# EAGLE design Sensor (EAGLE 7.2.0)
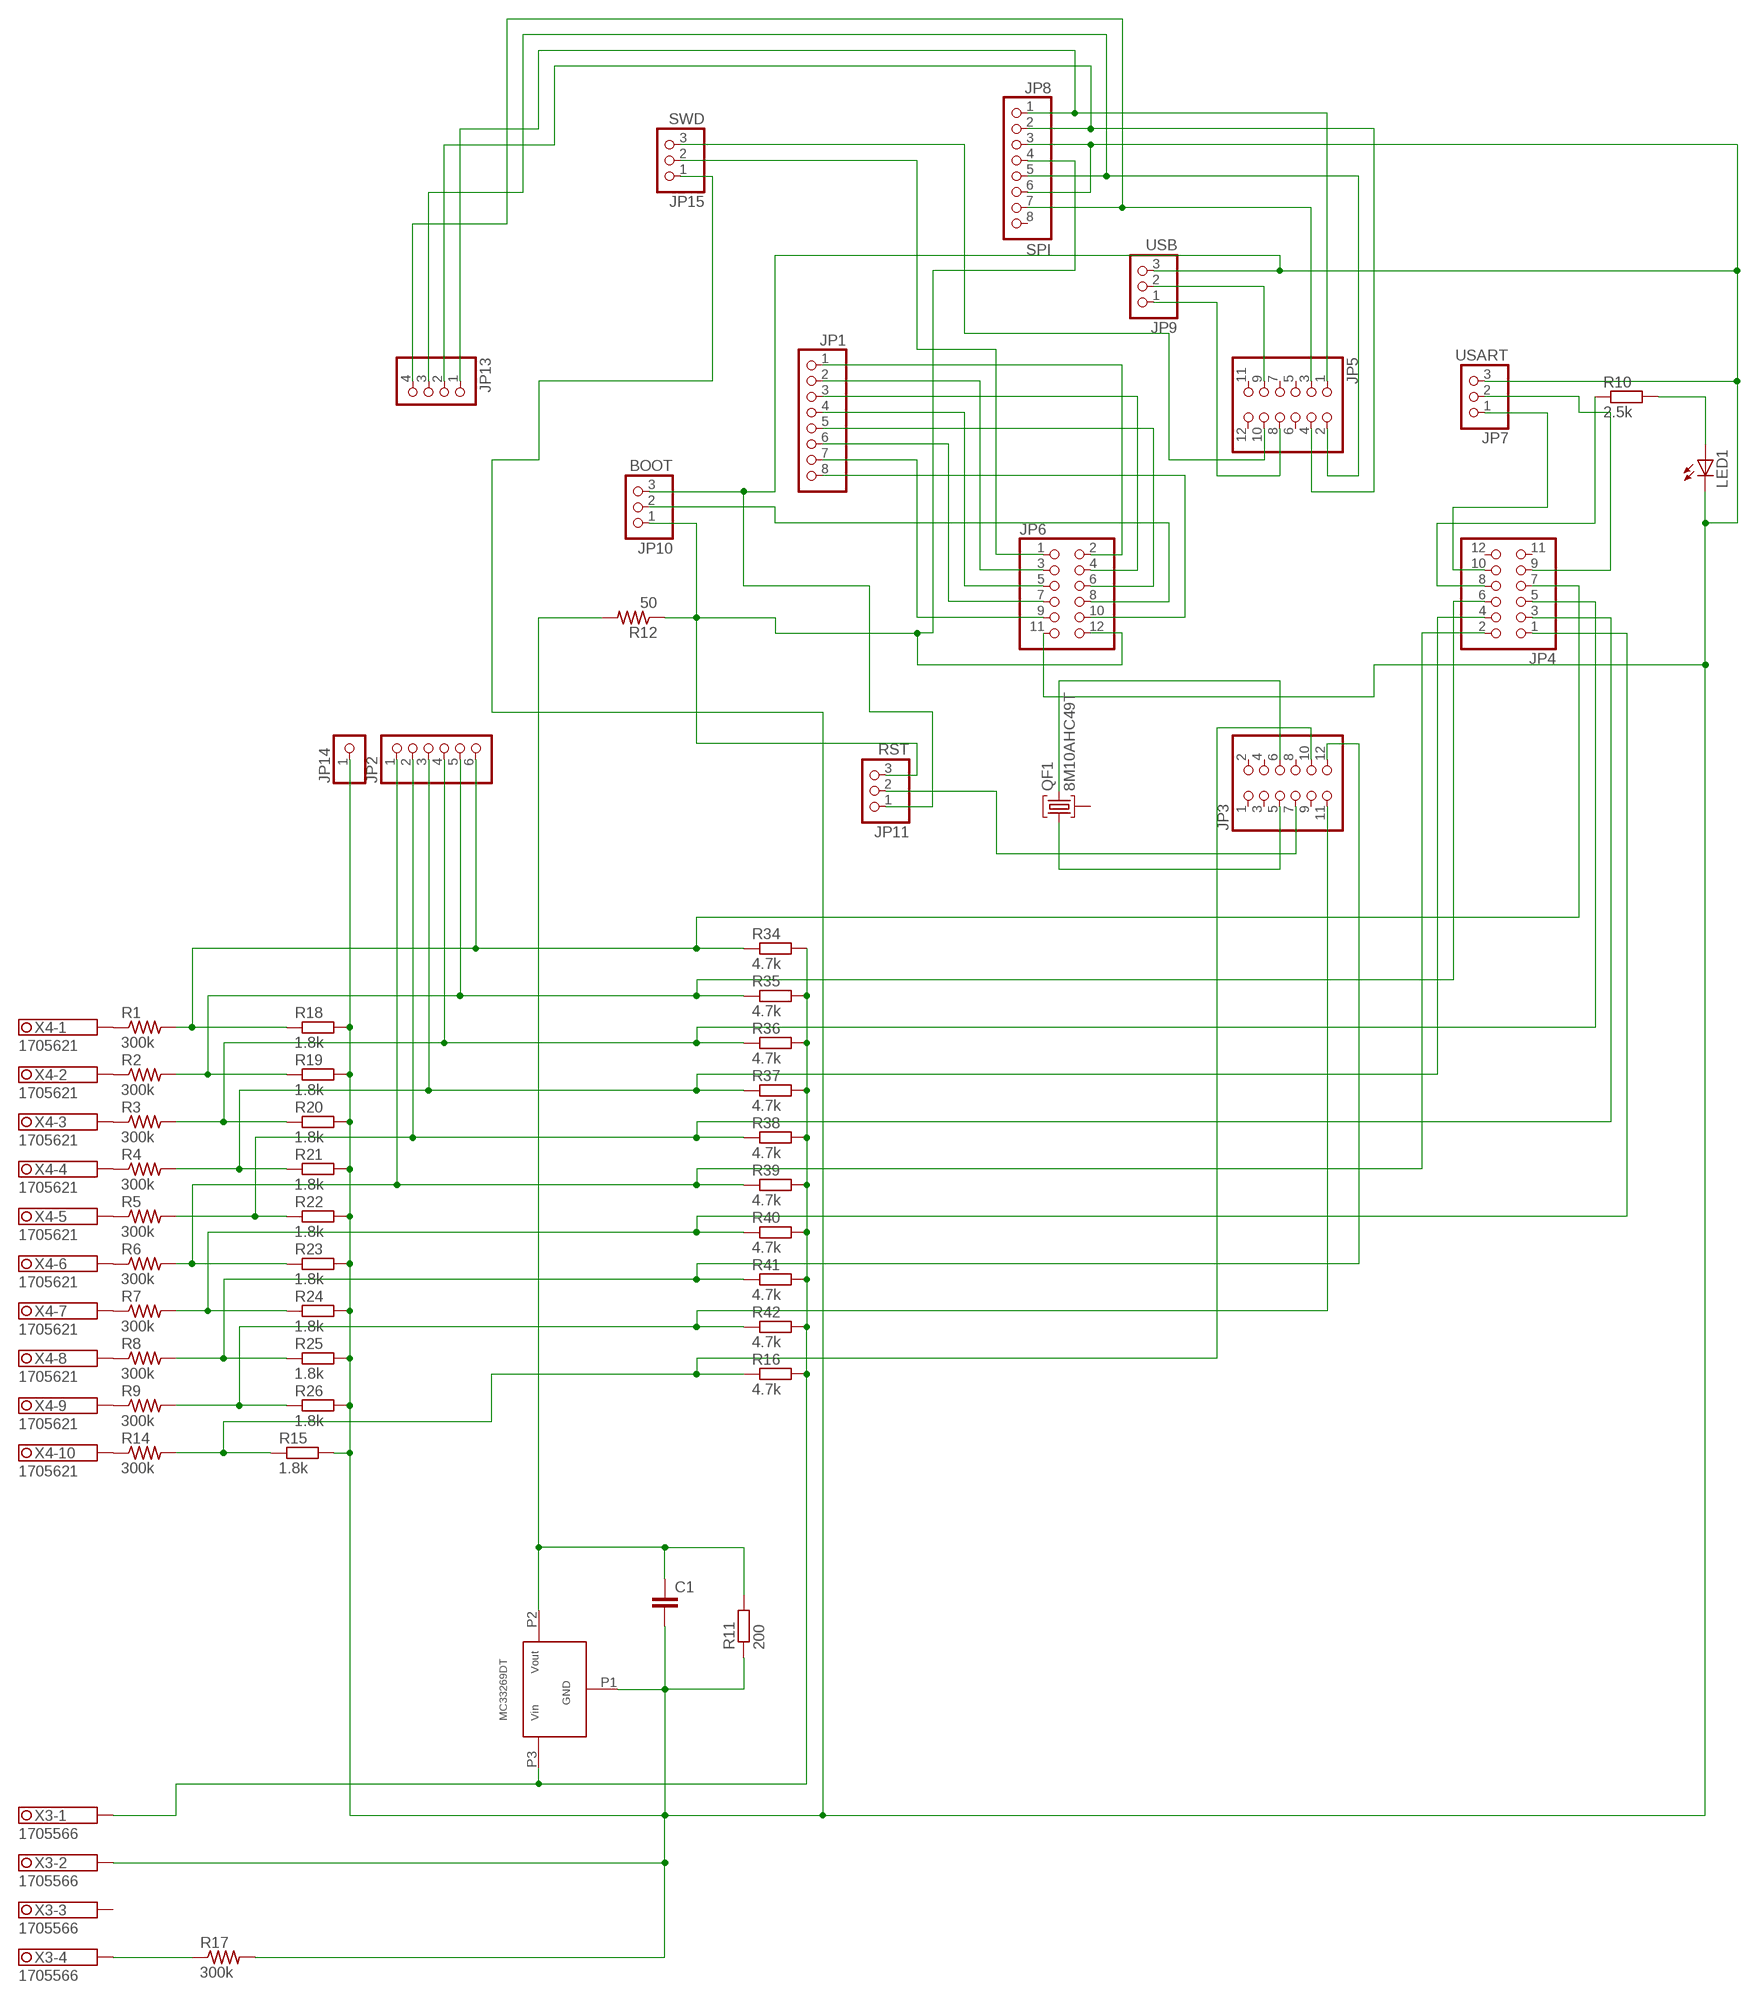
[diagram p0: schematic, sheet 1]

## Parts
C1  C2.5/6  [C2.5-6]
JP1  PINHD-1X8  [1X08]
JP2  PINHD-1X6  [1X06]
JP3  PINHD-2X6  [2X06]
JP4  PINHD-2X6  [2X06]
JP5  PINHD-2X6  [2X06]
JP6  PINHD-2X6  [2X06]
JP7  USART  PINHD-1X3  [1X03]
JP8  SPI  PINHD-1X8  [1X08]
JP9  USB  PINHD-1X3  [1X03]
JP10  BOOT  PINHD-1X3  [1X03]
JP11  RST  PINHD-1X3  [1X03]
JP13  PINHD-1X4  [1X04]
JP14  PINHD-1X1  [1X01]
JP15  SWD  PINHD-1X3  [1X03]
LED1  LED3MM  [LED3MM]
QF1  8M10AHC49T  [HC49U]
R1  300k  R-US_0207/15  [0207/15]
R2  300k  R-US_0207/15  [0207/15]
R3  300k  R-US_0207/15  [0207/15]
R4  300k  R-US_0207/15  [0207/15]
R5  300k  R-US_0207/15  [0207/15]
R6  300k  R-US_0207/15  [0207/15]
R7  300k  R-US_0207/15  [0207/15]
R8  300k  R-US_0207/15  [0207/15]
R9  300k  R-US_0207/15  [0207/15]
R10  2.5k  R-EU_M1206  [M1206]
R11  200  R-EU_R1206  [R1206]
R12  50  R-US_0207/15  [0207/15]
R14  300k  R-US_0207/15  [0207/15]
R15  1.8k  R-EU_R1206  [R1206]
R16  4.7k  R-EU_R1206  [R1206]
R17  300k  R-US_0207/15  [0207/15]
R18  1.8k  R-EU_R1206  [R1206]
R19  1.8k  R-EU_R1206  [R1206]
R20  1.8k  R-EU_R1206  [R1206]
R21  1.8k  R-EU_R1206  [R1206]
R22  1.8k  R-EU_R1206  [R1206]
R23  1.8k  R-EU_R1206  [R1206]
R24  1.8k  R-EU_R1206  [R1206]
R25  1.8k  R-EU_R1206  [R1206]
R26  1.8k  R-EU_R1206  [R1206]
R34  4.7k  R-EU_R1206  [R1206]
R35  4.7k  R-EU_R1206  [R1206]
R36  4.7k  R-EU_R1206  [R1206]
R37  4.7k  R-EU_R1206  [R1206]
R38  4.7k  R-EU_R1206  [R1206]
R39  4.7k  R-EU_R1206  [R1206]
R40  4.7k  R-EU_R1206  [R1206]
R41  4.7k  R-EU_R1206  [R1206]
R42  4.7k  R-EU_R1206  [R1206]
U$3  MC33269DT  [MC33269DT]
X3  1705566  [1705566]
X4  1705621  [1705621]

## Nets
N$1: JP3.10 R14.2 R15.1 R16.1
N$2: R17.1 X3.4.1 X3.4.2
N$3: R1.1 X4.1.1 X4.1.2
N$4: R2.1 X4.2.1 X4.2.2
N$5: R3.1 X4.3.1 X4.3.2
N$6: R4.1 X4.4.1 X4.4.2
N$7: R5.1 X4.5.1 X4.5.2
N$8: R6.1 X4.6.1 X4.6.2
N$9: R7.1 X4.7.1 X4.7.2
N$10: JP3.5 QF1.1
N$11: JP3.6 QF1.3
N$12: JP3.7 JP11.2
N$13: R8.1 X4.8.1 X4.8.2
N$14: LED1.A R10.2
N$16: JP4.8 R10.1
N$17: R16.2 R34.2 R35.2 R36.2 R37.2 R38.2 R39.2 R40.2 R41.2 R42.2 U$3.P3(VIN) X3.1.1 X3.1.2
N$18: JP2.6 JP4.7 R1.2 R18.1 R34.1
N$19: JP2.5 JP4.6 R2.2 R19.1 R35.1
N$20: JP2.4 JP4.5 R3.2 R20.1 R36.1
N$21: JP2.3 JP4.4 R4.2 R21.1 R37.1
N$22: JP2.2 JP4.3 R5.2 R22.1 R38.1
N$23: JP2.1 JP4.2 R6.2 R23.1 R39.1
N$24: JP4.1 R7.2 R24.1 R40.1
N$25: JP3.12 R8.2 R25.1 R41.1
N$26: JP3.11 R9.2 R26.1 R42.1
N$27: JP4.9 JP7.2
N$28: JP4.10 JP7.1
N$29: C1.2 JP6.11 JP7.3 JP8.3 JP8.6 JP9.3 JP10.3 JP11.1 JP14.1 JP15.1 LED1.K(C) R11.1 R15.2 R17.2 R18.2 R19.2 R20.2 R21.2 R22.2 R23.2 R24.2 R25.2 R26.2 U$3.P1(GND) X3.2.1 X3.2.2
N$30: C1.1 R11.2 R12.2 U$3.P2(VOUT)
N$31: JP5.8 JP9.1
N$32: JP5.9 JP9.2
N$34: JP5.10 JP15.3
N$35: JP6.1 JP15.2
N$36: JP5.1 JP8.1 JP13.1
N$37: JP5.4 JP8.2 JP13.2
N$38: JP5.2 JP8.5 JP13.3
N$39: JP5.3 JP8.7 JP13.4
N$40: JP6.12 JP8.4 JP10.1 JP11.3 R12.1
N$42: JP1.1 JP6.2
N$45: JP1.2 JP6.3
N$46: JP1.3 JP6.4
N$47: JP1.4 JP6.5
N$48: JP1.5 JP6.6
N$49: JP1.6 JP6.7
N$50: JP1.7 JP6.9
N$51: JP1.8 JP6.10
N$53: R9.1 X4.9.1 X4.9.2
N$54: R14.1 X4.10.1 X4.10.2
N$56: JP6.8 JP10.2
Unconnected: JP3.1 JP3.2 JP3.3 JP3.4 JP3.8 JP3.9 JP4.11 JP4.12 JP5.5 JP5.6 JP5.7 JP5.11 JP5.12 JP8.8 QF1.2 X3.3.1 X3.3.2

## Library data of the parts
C1 = capacitor-wima:C: CAPACITOR naming: grid - package width
JP1 JP8 = pinhead:PINHD-1X8: PIN HEADER
JP2 = pinhead:PINHD-1X6: PIN HEADER
JP3-JP6 = pinhead:PINHD-2X6: PIN HEADER
JP7 JP9-JP11 JP15 = pinhead:PINHD-1X3: PIN HEADER
JP13 = pinhead:PINHD-1X4: PIN HEADER
JP14 = pinhead:PINHD-1X1: PIN HEADER
LED1 = led:LED: LED OSRAM: - CHIPLED LG R971, LG N971, LY N971, LG Q971, LY Q971, LO R971, LY R971 LH N974, LH R974 LS Q976, LO Q976, LY Q976 LO Q996 - Hyper CHIPLED LW Q18S LB Q993, LB Q99A, LB R99A - SideLED LS A670, LO A670, LY A670, LG A670, LP A670 LB A673, LV A673, LT A673, LW A673 LH A674 LY A675 LS A676, LA A676, LO A676, LY A676, LW A676 LS A679, LY A679, LG A679 - Hyper Micro SIDELED® LS Y876, LA Y876, LO Y876, LY Y876 LT Y87S - SmartLED LW L88C, LW L88S LB L89C, LB L89S, LG L890 LS L89K, LO L89K, LY L89K LS L896, LA L896, LO L896, LY L896 - TOPLED LS T670, LO T670, LY T670, LG T670, LP T670 LSG T670, LSP T670, LSY T670, LOP T670, LYG T670 LG T671, LOG T671, LSG T671 LB T673, LV T673, LT T673, LW T673 LH T674 LS T676, LA T676, LO T676, LY T676, LB T676, LH T676, LSB T676, LW T676 LB T67C, LV T67C, LT T67C, LS T67K, LO T67K, LY T67K, LW E67C LS E67B, LA E67B, LO E67B, LY E67B, LB E67C, LV E67C, LT E67C LW T67C LS T679, LY T679, LG T679 LS T770, LO T770, LY T770, LG T770, LP T770 LB T773, LV T773, LT T773, LW T773 LH T774 LS E675, LA E675, LY E675, LS T675 LS T776, LA T776, LO T776, LY T776, LB T776 LHGB T686 LT T68C, LB T68C - Hyper Mini TOPLED® LB M676 - Mini TOPLED Santana® LG M470 LS M47K, LO M47K, LY M47K Source: http://www.osram.convergy.de LUXEON: - LUMILED® LXK2-PW12-R00, LXK2-PW12-S00, LXK2-PW14-U00, LXK2-PW14-V00 LXK2-PM12-R00, LXK2-PM12-S00, LXK2-PM14-U00 LXK2-PE12-Q00, LXK2-PE12-R00, LXK2-PE12-S00, LXK2-PE14-T00, LXK2-PE14-U00 LXK2-PB12-K00, LXK2-PB12-L00, LXK2-PB12-M00, LXK2-PB14-N00, LXK2-PB14-P00, LXK2-PB14-Q00 LXK2-PR12-L00, LXK2-PR12-M00, LXK2-PR14-Q00, LXK2-PR14-R00 LXK2-PD12-Q00, LXK2-PD12-R00, LXK2-PD12-S00 LXK2-PH12-R00, LXK2-PH12-S00 LXK2-PL12-P00, LXK2-PL12-Q00, LXK2-PL12-R00 Source: www.luxeon.com KINGBRIGHT: KA-3528ASYC Source: www.kingbright.com
QF1 = crystal:8M10AHC49T: Monolithic Crystal Filters Source: www.vanlong.com; OC_FARNELL: unknown; OC_NEWARK: unknown
R1-R9 R12 R14 R17 = resistor:R-US_: RESISTOR, American symbol
R10 R11 R15 R16 R18-R26 R34-R42 = resistor:R-EU_: RESISTOR, European symbol
U$3 = mc33269dt:MC33269DT
X3 = con-phoenix-3.81:1705566: MKDSD 1,5/ 4-3,81 Printklemme Nennstrom: 8 A Bemessungsspannung: 200 V Raster: 3,81 mm Polzahl: 4 Montageart: Löten Anschlussart: Schraubanschluss Anschlussrichtung vom Leiter zur Platine: 0° Source: http://eshop.phoenixcontact.com .. 1705566.pdf; OC_FARNELL: unknown; OC_NEWARK: unknown
X4 = con-phoenix-3.81:1705621: MKDSD 1,5/10-3,81 Printklemme Nennstrom: 8 A Bemessungsspannung: 200 V Raster: 3,81 mm Polzahl: 12 Montageart: Löten Anschlussart: Schraubanschluss Anschlussrichtung vom Leiter zur Platine: 0° Source: http://eshop.phoenixcontact.com .. 1705621.pdf; OC_FARNELL: unknown; OC_NEWARK: unknown

## Net classes
0 default: width 2.032 mm, clearance 0.205 mm

## Board
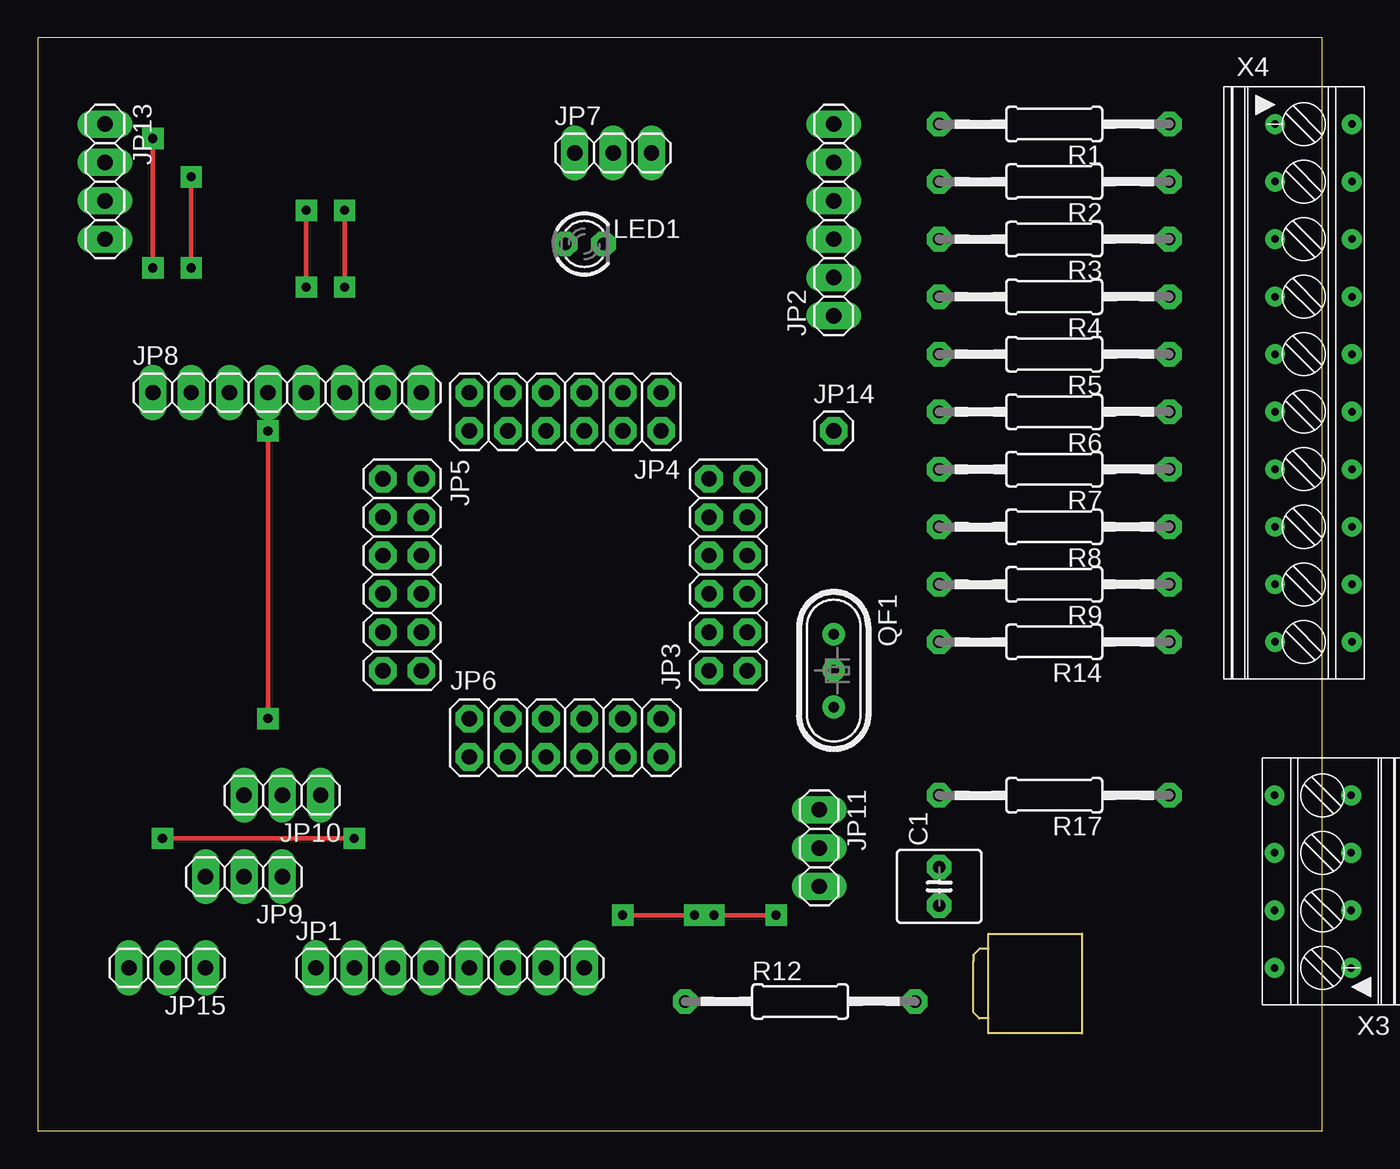
[diagram p1: board, top side]
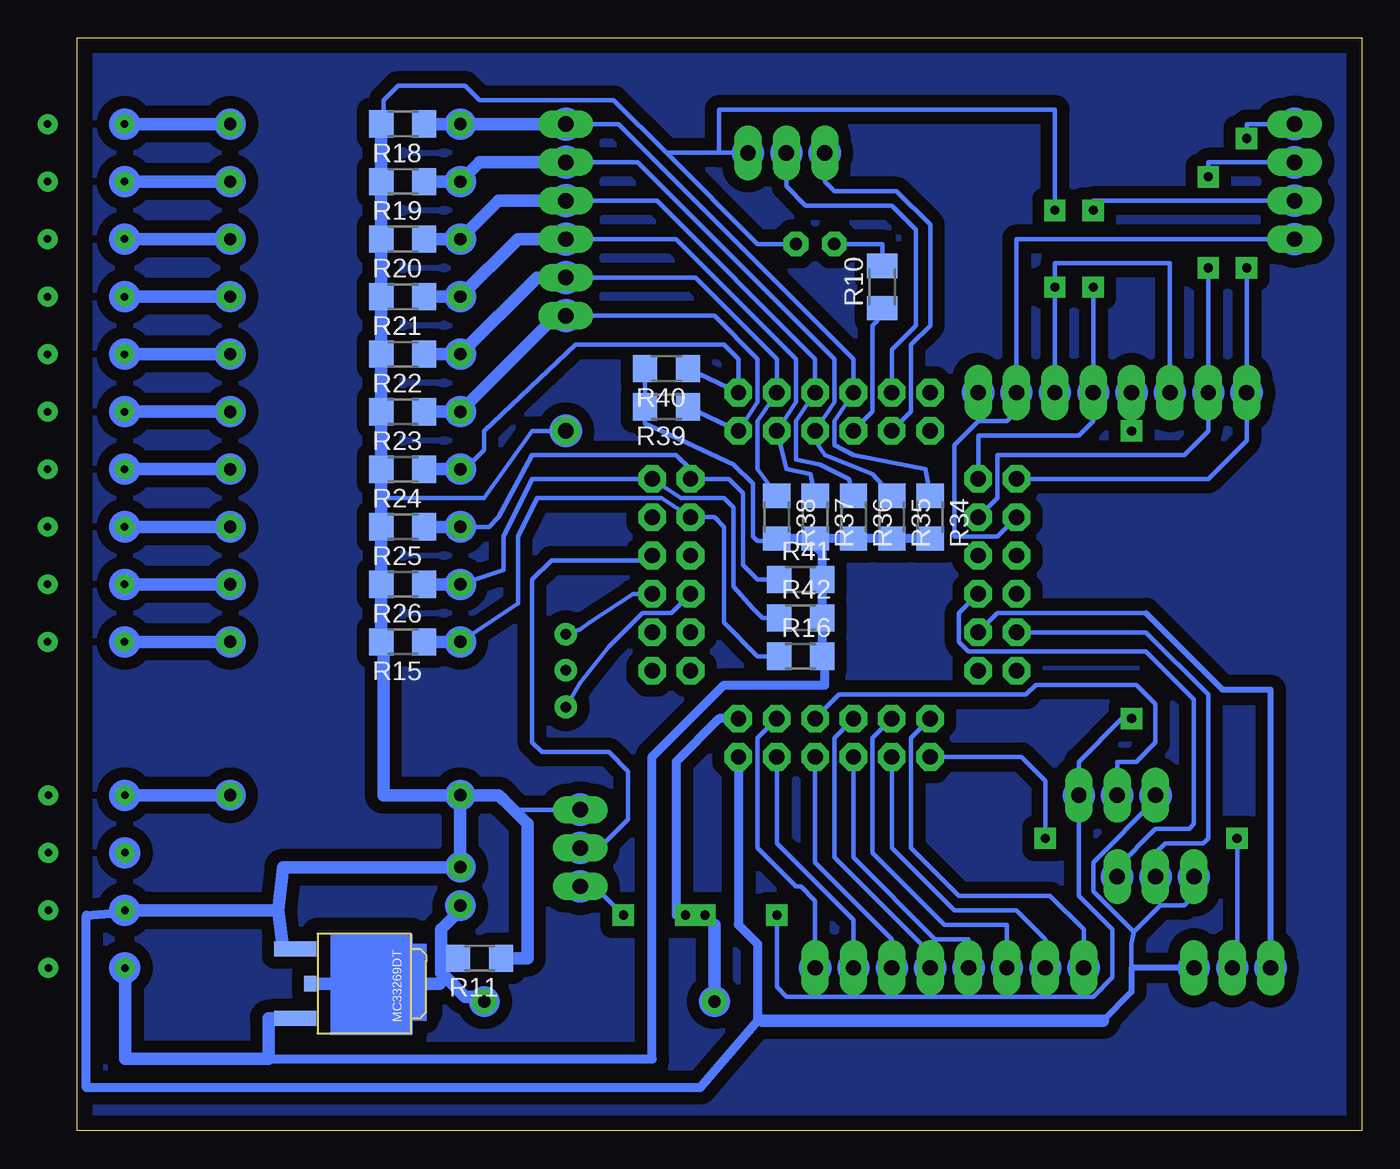
[diagram p2: board, bottom side, seen from below]

Size 85.07 x 72.39 mm. Coordinates in mm from the lower left corner, seen from the top.
Outline: 0,0 85.07,0 85.07,72.39 0,72.39 0,0
Copper layers (1*16): Top 0.035mm / dielectric 1.5mm / Bottom 0.035mm
Design rules "default *": minimum track width 10mil, minimum drill 24mil, track to track 8mil, track to pad 8mil, pad to pad 8mil, via to via 8mil, smd to smd 8mil, copper to edge 40mil, drill to drill 8mil, minimum pad ring 16mil, minimum via ring 16mil, stop-mask expansion 4mil, vias tented up to drill 0mil, thermal gap 10mil

### Footprints (pad centres in the part's own frame; a part is rotated, then mirrored left to right if it is on the bottom)
C2.5-6 = drill 0.813 pad 1.6 octagon: 1 -1.27,0; 2 1.27,0
1X08 = drill 1.016 long: 1 -8.89,0; 2 -6.35,0; 3 -3.81,0; 4 -1.27,0; 5 1.27,0; 6 3.81,0; 7 6.35,0; 8 8.89,0
1X06 = drill 1.016 long: 1 -6.35,0; 2 -3.81,0; 3 -1.27,0; 4 1.27,0; 5 3.81,0; 6 6.35,0
2X06 = drill 1.016 octagon: 1 -6.35,-1.27; 2 -6.35,1.27; 3 -3.81,-1.27; 4 -3.81,1.27; 5 -1.27,-1.27; 6 -1.27,1.27; 7 1.27,-1.27; 8 1.27,1.27; 9 3.81,-1.27; 10 3.81,1.27; 11 6.35,-1.27; 12 6.35,1.27
1X03 = drill 1.016 long: 1 -2.54,0; 2 0,0; 3 2.54,0
1X04 = drill 1.016 long: 1 -3.81,0; 2 -1.27,0; 3 1.27,0; 4 3.81,0
1X01 = drill 1.016 octagon: 1 0,0
LED3MM = drill 0.813 octagon: A -1.27,0; K 1.27,0
HC49U = drill 0.7 pad 1.2: 1 -2.413,0; 2 -0.027,0; 3 2.413,0
0207/15 = drill 0.813 octagon: 1 -7.62,0; 2 7.62,0
M1206 = smd 1.6 x 2: 1 -1.4,0; 2 1.4,0
R1206 = smd 1.6 x 1.803: 1 -1.422,0; 2 1.422,0
MC33269DT = smd 1 x 2.8: P1 -2.2,-4.59; P3 2.38,-4.59 | smd 1 x 0.8: P2 0.09,-3.59
1705566 = drill 0.5 pad 0.9: 1.1 -5.715,-1.25; 1.2 -5.715,3.83; 2.1 -1.905,-1.25; 2.2 -1.905,3.83; 3.1 1.905,-1.25; 3.2 1.905,3.83; 4.1 5.715,-1.25; 4.2 5.715,3.83
1705621 = drill 0.5 pad 0.9: 1.1 -17.145,-1.25; 1.2 -17.145,3.83; 2.1 -13.335,-1.25; 2.2 -13.335,3.83; 3.1 -9.525,-1.25; 3.2 -9.525,3.83; 4.1 -5.715,-1.25; 4.2 -5.715,3.83; 5.1 -1.905,-1.25; 5.2 -1.905,3.83; 6.1 1.905,-1.25; 6.2 1.905,3.83; 7.1 5.715,-1.25; 7.2 5.715,3.83; 8.1 9.525,-1.25; 8.2 9.525,3.83; 9.1 13.335,-1.25; 9.2 13.335,3.83; 10.1 17.145,-1.25; 10.2 17.145,3.83

### Placement (x,y rotation side)
C1  59.69,16.19 90 top
JP1  27.3,10.79 0 top
JP2  52.7,60.33 90 top
JP3  45.72,36.83 90 top
JP4  34.92,47.62 180 top
JP5  24.13,36.83 270 top
JP6  34.92,26.04 0 top
JP7  38.1,64.77 0 top
JP8  16.51,48.9 0 top
JP9  13.65,16.83 180 top
JP10  16.19,22.23 180 top
JP11  51.75,18.73 270 top
JP13  4.45,62.87 270 top
JP14  52.7,46.35 0 top
JP15  8.57,10.79 180 top
LED1  36.2,58.74 0 top
QF1  52.7,30.48 270 top
R1  67.31,66.67 180 top
R2  67.31,62.87 180 top
R3  67.31,59.05 180 top
R4  67.31,55.24 180 top
R5  67.31,51.44 180 top
R6  67.31,47.62 180 top
R7  67.31,43.81 180 top
R8  67.31,40.01 180 top
R9  67.31,36.2 180 top
R10  31.75,55.88 90 bottom
R11  58.42,11.43 180 bottom
R12  50.48,8.57 0 top
R14  67.31,32.38 180 top
R15  63.5,32.38 180 bottom
R16  37.15,31.43 0 bottom
R17  67.31,22.23 180 top
R18  63.5,66.67 180 bottom
R19  63.5,62.87 180 bottom
R20  63.5,59.05 180 bottom
R21  63.5,55.24 180 bottom
R22  63.5,51.44 180 bottom
R23  63.5,47.62 180 bottom
R24  63.5,43.81 180 bottom
R25  63.5,40.01 180 bottom
R26  63.5,36.2 180 bottom
R34  28.57,40.64 270 bottom
R35  31.11,40.64 270 bottom
R36  33.66,40.64 270 bottom
R37  36.2,40.64 270 bottom
R38  38.73,40.64 270 bottom
R39  46.04,47.94 180 bottom
R40  46.04,50.48 180 bottom
R41  37.15,36.51 0 bottom
R42  37.15,33.97 0 bottom
U$3  66.04,9.84 270 bottom
X3  85.72,16.51 90 top
X4  83.19,49.53 270 top

### Tracks (layer width: path | path; a pad name or v marks a point on that pad's centre or on a via)
N$1
  Bottom 0.305: R14.2 55.88,34.92 55.88,39.37 54.61,41.91 46.35,41.91 JP3.10 42.86,40.64 42.23,40.01 42.23,33.66 40.01,31.43 R16.1
  Bottom 0.813: R14.2 R15.1
N$2
  Bottom 0.813: R17.1 X3.4.2
N$3
  Bottom 0.813: R1.1 X4.1.1
N$4
  Bottom 0.813: R2.1 X4.2.1
N$5
  Bottom 0.813: R3.1 X4.3.1
N$6
  Bottom 0.813: R4.1 X4.4.1
N$7
  Bottom 0.813: R5.1 X4.5.1
N$8
  Bottom 0.813: R6.1 X4.6.1
N$9
  Bottom 0.813: R7.1 X4.7.1
N$10
  Bottom 0.305: JP3.5 48.26,35.56 51.12,33.66 51.75,33.21 QF1.1
N$11
  Bottom 0.305: JP3.6 45.72,34.29 47.62,34.29 49.85,32.07 51.75,29.65 QF1.3
N$12
  Bottom 0.305: JP11.2 50.48,18.73 48.58,20.64 48.58,23.81 49.85,25.08 54.29,25.08 54.93,25.72 54.93,36.51 53.66,37.78 47.31,37.78 JP3.7
N$13
  Bottom 0.813: R8.1 X4.8.1
N$14
  Bottom 0.305: R10.2 31.75,58.74 LED1.A
N$16
  Bottom 0.305: JP4.8 32.38,47.62 32.38,53.34 32.07,53.66 32.07,54.16 R10.1
N$17
  Bottom 0.305: R40.2 R39.2 47.46,46.83 45.72,46.04 41.59,44.13 40.32,42.86 40.32,39.37 40.01,39.05 38.9,39.05 R38.2
  Bottom 0.61: 72.39,4.76 46.99,4.76 46.99,24.77 42.23,29.53 35.56,29.53 35.56,31.27 R16.2 R42.2 R41.2 35.73,38.27 36.2,38.73 R37.2 | R34.2 R35.2 R36.2 R37.2 | R37.2 R38.2
  Bottom 0.813: U$3.P3 72.39,7.46 72.39,4.76 81.89,4.76 X3.1.2
N$18
  Bottom 0.305: R34.1 28.89,43.81 33.66,44.77 34.92,45.4 34.92,46.99 JP4.7 33.66,51.12 49.21,66.67 JP2.6
  Bottom 0.813: R18.1 R1.2 JP2.6
N$19
  Bottom 0.305: R35.1 32.38,43.5 35.56,44.77 36.2,45.72 JP4.6 34.92,48.26 34.92,51.12 47.94,64.14 JP2.5
  Bottom 0.813: R19.1 R2.2 58.42,64.14 JP2.5
N$20
  Bottom 0.305: R36.1 33.97,43.18 35.88,44.13 37.47,44.45 37.47,46.99 JP4.5 36.2,51.12 46.67,61.59 JP2.4
  Bottom 0.813: R20.1 R3.2 57.15,61.59 JP2.4
N$21
  Bottom 0.305: R37.1 36.51,43.5 38.1,43.81 JP4.4 37.47,48.26 37.47,51.12 45.4,59.05 JP2.3
  Bottom 0.813: R21.1 R4.2 55.88,59.05 JP2.3
N$22
  Bottom 0.305: R38.1 40.01,43.81 40.01,46.99 JP4.3 38.73,51.12 44.13,56.52 JP2.2
  Bottom 0.813: R22.1 R5.2 54.61,56.52 JP2.2
N$23
  Bottom 0.305: R39.1 JP4.2 40.01,48.26 40.01,51.12 42.86,53.98 JP2.1
  Bottom 0.813: R23.1 R6.2 53.34,53.98 JP2.1
N$24
  Bottom 0.305: R7.2 59.37,43.81 58.1,45.09 58.1,46.35 52.07,52.07 42.23,52.07 41.27,51.12 JP4.1 R40.1
  Bottom 0.813: R7.2 R24.1
N$25
  Bottom 0.305: R8.2 57.78,40.01 57.15,40.64 54.93,44.77 45.4,44.77 44.45,43.81 JP3.12 41.91,43.18 40.96,42.23 40.96,37.47 40.01,36.51 R41.1
  Bottom 0.813: R25.1 R8.2
N$26
  Bottom 0.305: R9.2 56.83,37.15 56.83,39.37 54.93,43.18 JP3.11 45.09,41.91 42.23,41.91 41.59,41.27 41.59,36.04 40.32,34.61 39.69,33.97 R42.1
  Bottom 0.813: R9.2 R26.1
N$27
  Bottom 0.305: JP4.9 31.11,51.75 29.53,53.34 29.53,59.69 31.11,61.28 36.83,61.28 38.1,62.55 JP7.2
N$28
  Bottom 0.305: JP4.10 29.84,47.62 29.84,52.07 28.57,53.34 28.57,60.01 30.8,62.23 34.92,62.23 35.56,62.87 JP7.1
N$29  (via drill 0.6)
  Top 0.305: v20.32,55.88 v20.32,60.96
  Bottom 0.305: 64.92,42.23 64.61,41.91 58.1,41.91 54.93,46.35 JP14.1 52.7,46.04 | LED1.K 40.01,58.74 46.04,64.77 | 46.04,64.77 49.53,68.26 58.42,68.26 59.37,69.22 63.82,69.22 64.77,68.26 64.77,66.83 R18.2 | JP7.3 42.55,64.77 | 42.55,64.77 46.04,64.77 | JP11.1 56.2,21.27 56.83,21.91 | JP8.6 v20.32,55.88 20.32,57.47 12.7,57.47 JP8.3 | v20.32,60.96 20.32,67.63 42.55,67.63 42.55,64.77 | 39.69,7.3 40.01,8.26 | JP9.3 11.11,15.56 11.75,14.92 13.34,14.92 15.08,13.18 | 15.08,13.18 15.24,12.38 15.24,10.79 | JP10.3 13.65,21.91 17.78,17.78 17.78,15.88 15.08,13.18
  Bottom 0.406: JP15.1 15.24,10.79 15.24,9.21 17.14,7.3
  Bottom 0.61: JP6.11 41.27,13.65 40.01,12.38 40.01,8.26 40.01,7.3 43.81,2.86 84.45,2.86 84.45,14.29 80.33,14.61
  Bottom 0.813: R17.2 64.77,22.23 64.77,32.23 R15.2 R26.2 R25.2 64.92,42.23 R24.2 R23.2 R22.2 R21.2 R20.2 R19.2 R18.2 | X3.2.2 80.33,14.61 71.75,14.61 | U$3.P1 71.44,12.04 71.75,14.61 | R17.2 C1.2 71.44,17.46 71.75,14.61 | R17.2 57.15,22.23 56.83,21.91 55.24,20.32 55.24,11.43 R11.1 | 17.14,7.3 39.69,7.3
N$30
  Bottom 0.813: C1.1 59.69,14.61 60.96,13.34 60.96,11.43 | 60.96,11.43 60.96,10.48 60.64,10.16 | 60.64,10.16 59.37,8.89 58.42,8.89 R12.2 | U$3.P2 61.05,9.75 60.64,10.16 | R11.2 60.96,11.43
N$31
  Bottom 0.305: JP9.1 16.19,17.46 13.65,20 11.43,20 11.11,20.32 11.11,28.57 14.29,31.75 26.04,31.75 26.67,32.38 26.67,34.29 JP5.8
N$32
  Bottom 0.305: JP9.2 13.65,18.41 13.02,19.05 10.48,19.05 10.16,19.37 10.16,28.89 14.29,33.02 JP5.9
N$33
  pour Bottom (isolate 0.813): 0,72.39 85.09,72.39 85.09,0 0,0
N$34
  Bottom 0.305: 14.29,34.29 24.13,34.29 JP5.10
  Bottom 0.406: JP15.3 6.03,29.21 9.21,29.21 14.29,34.29
N$35  (via drill 0.6)
  Top 0.305: v20.95,19.37 v8.26,19.37
  Bottom 0.305: JP6.1 22.54,24.77 20.95,23.18 v20.95,19.37 | v8.26,19.37 8.26,11.11 JP15.2
N$36  (via drill 0.6)
  Top 0.305: v7.62,65.72 v7.62,57.15
  Bottom 0.305: JP5.1 10.16,43.18 7.62,45.72 JP8.1 v7.62,57.15 | v7.62,65.72 7.62,66.67 JP13.1
N$37  (via drill 0.6)
  Top 0.305: v10.16,63.18 v10.16,57.15
  Bottom 0.305: JP5.4 24.13,41.91 24.13,44.77 11.75,44.77 10.16,46.35 JP8.2 v10.16,57.15 | v10.16,63.18 10.16,64.14 JP13.2
N$38  (via drill 0.6)
  Top 0.305: v17.78,60.96 v17.78,55.88
  Bottom 0.305: JP5.2 25.4,46.04 18.73,46.04 17.78,46.99 JP8.5 v17.78,55.88 | v17.78,60.96 17.78,61.59 JP13.3
N$39
  Bottom 0.305: JP5.3 24.13,39.37 26.99,39.37 26.99,45.4 25.4,46.99 23.5,46.99 22.86,47.62 JP8.7 22.86,59.05 JP13.4
N$40  (via drill 0.6)
  Top 0.305: v43.5,14.29 v38.73,14.29 | v48.9,14.29 v44.77,14.29 | v15.24,46.35 v15.24,27.3
  Bottom 0.305: v38.73,14.29 38.73,9.53 38.1,8.89 17.78,8.89 16.51,10.16 16.51,13.34 18.73,15.56 JP10.1 18.73,24.45 15.88,27.3 v15.24,27.3 | JP11.3 50.8,16.19 v48.9,14.29 | JP8.4 v15.24,46.35
  Bottom 0.61: JP6.12 42.55,27.3 45.4,24.45 45.4,14.29 v44.77,14.29 v43.5,14.29 42.86,13.65
  Bottom 0.813: R12.1 42.86,13.65
N$42
  Bottom 0.305: JP6.2 29.84,26.04 29.84,18.73 26.67,15.56 20.64,15.56 18.41,13.34 JP1.1
N$45
  Bottom 0.305: JP6.3 31.11,18.73 26.99,14.61 22.86,14.61 20.95,12.7 JP1.2
N$46
  Bottom 0.305: JP6.4 32.38,26.04 32.38,18.41 27.62,13.65 23.5,13.65 JP1.3
N$47
  Bottom 0.305: JP6.5 33.66,18.1 28.26,12.7 26.04,12.7 JP1.4
N$48
  Bottom 0.305: JP6.6 34.92,26.04 34.92,18.1 28.57,11.75 JP1.5
N$49
  Bottom 0.305: JP6.7 36.2,17.78 31.11,12.7 JP1.6
N$50
  Bottom 0.305: JP6.9 38.73,19.05 33.66,13.97 JP1.7
N$51
  Bottom 0.305: JP6.10 40.01,26.04 40.01,18.73 37.47,16.19 37.15,16.19 36.2,15.24 JP1.8
N$53
  Bottom 0.813: R9.1 X4.9.1
N$54
  Bottom 0.813: R14.1 X4.10.1
N$56
  Bottom 0.305: JP6.8 34.61,28.89 22.23,28.89 21.59,29.53 14.92,29.53 13.65,28.26 13.65,25.72 14.92,24.45 16.19,24.45 JP10.2
(copper drawn outside any net)
  shapes: Bottom area x2, Bottom circle x83

### Text on the board
tTest: A10 | RX | TX | USART | A09 | A08 | A07 | A06 | SD-CARD | A05 | A04 | A03 | A02 | A01 | - | + | N | BOOT | - | RST | USB | + | GND | SWD | +5V | IO | CLK | GND